# Altium schematic sheet sd_card.SchDoc
size B
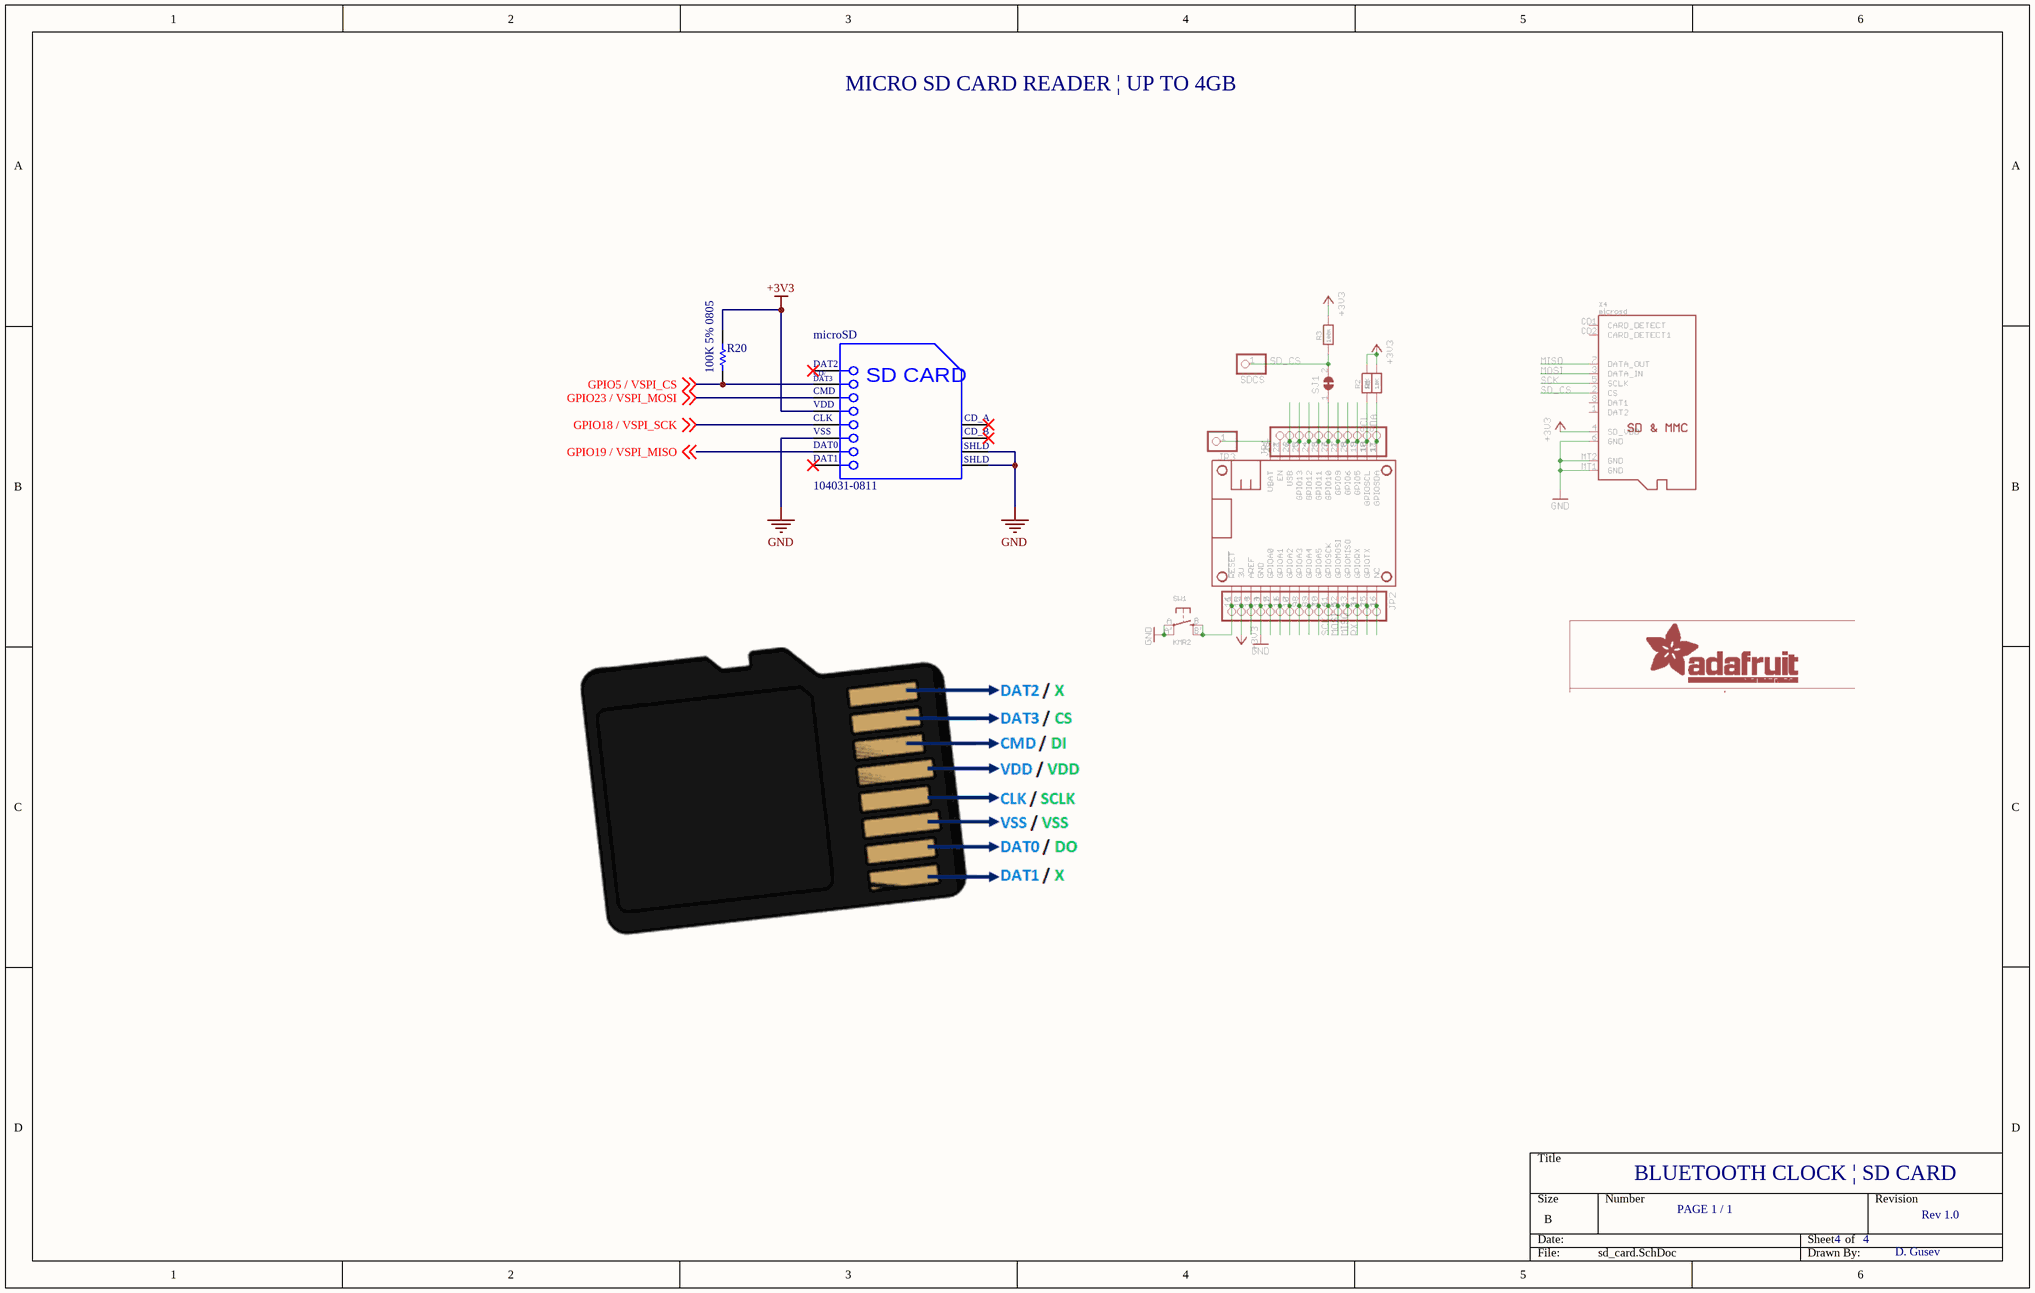
[diagram p0: sd_card.SchDoc]

## Parts
microSD  104031-0811  [MOLX-104031-0811_V]
R20  100K 5% 0805  [RESC2013X70X40ML20T20]

## Nets
+3V3: microSD.4(VDD) R20.2
GND: microSD.6(VSS2) microSD.11(SHLD1) microSD.12(SHLD2)
GPIO5 / VSPI_CS: microSD.2(CMD) R20.1 ; off-sheet GPIO5 / VSPI_CS
GPIO18 / VSPI_SCK: microSD.5(CLK) ; off-sheet GPIO18 / VSPI_SCK
GPIO19 / VSPI_MISO: microSD.7(DAT0) ; off-sheet GPIO19 / VSPI_MISO
GPIO23 / VSPI_MOSI: microSD.3(VSS1) ; off-sheet GPIO23 / VSPI_MOSI

Not connected (* = marked no-connect by the designer): microSD 1(CD/DAT3)* 8(DAT1)* 9(CD_A)* 10(CD_B)*

## Notes on the sheet
- MICRO SD CARD READER | UP TO 4GB
- BLUETOOTH CLOCK | SD CARD
- PAGE 1 / 1
- 4
- Rev 1.0
- D. Gusev
- (in symbol CMP-2000-05825-1) DAT2; CD/; DAT3; SD CARD; VSS; SHLD

## Library data of the parts
microSD = CMP-2000-05825-1: Micro SD Card, RA, -25 to 85 degC, 8-Pin SMD, RoHS, Tape and Reel; Voltage Rating: 10VAC/DC; Number of Contacts: 8; Insertion - Extraction Style: Push-Pull; Pitch: 1.1mm; Mating Cycles: 10000; Brand: Molex; Current Rating: 500mA; Manufacturer URL: http://www.molex.com/; Card Type: microSD; Mounting Type: Standard; Height: 1.42mm; Mounting Technology: SurfaceMount; Contact Plating: Gold; Product Category: MemoryCardConnectors; Package Description: 8-Pin Surface Mount Device, Body 11.95 x 11.4 mm, Pitch 1.1 mm; Datasheet URL: http://www.molex.com/pdm_docs/sd/1040310811_sd.pdf; Termination Style: SMD; Length: 11.4mm; Housing Material: LiquidCrystalPolymer(LCP); Orientation: RightAngle; RoHS: True; Contact Material: PhosphorBronze; Datasheet Version: Rev. E, 04/2006; Packaging: Reel; Manufacturer: Molex; Series: 104031; Product: CardConnectors; Number of Rows: 1Row; Package Reference: 104031-0811
R20 = CMP-2001-04377-1: Part Number: ERJ-6ENF1003V; Manufacturer: Panasonic